# EAGLE design controller (EAGLE 9.2.2)
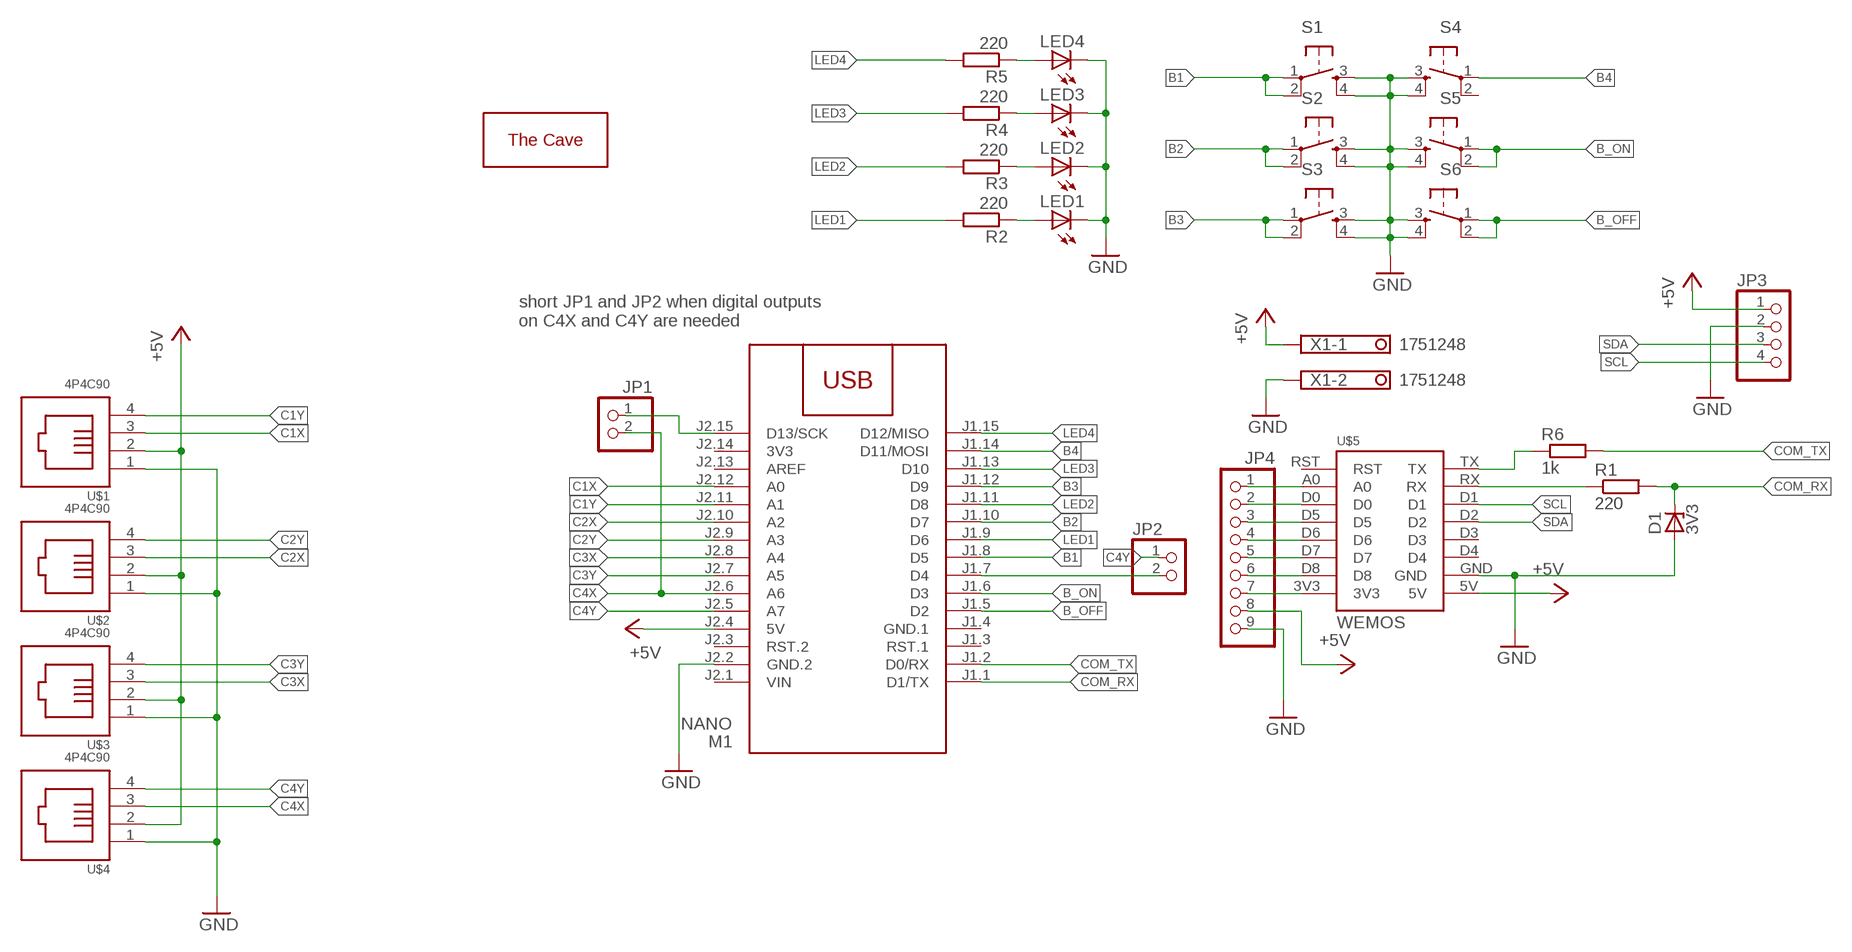
[diagram p0: schematic, sheet 1]

## Parts
D1  3V3  ZENER-DIODEZD-7.5  [ZDIO-7.5]
JP1  PINHD-1X2  [1X02]
JP2  PINHD-1X2  [1X02]
JP3  PINHD-1X4  [1X04]
JP4  PINHD-1X9  [1X09]
LED1  LED5MM  [LED5MM]
LED2  LED5MM  [LED5MM]
LED3  LED5MM  [LED5MM]
LED4  LED5MM  [LED5MM]
M1  NANO  ARDUINO-NANO-3.0#NOHOLE  [ARDUINO-NANO-3.0#NOHOLE]
R1  220  R-EU_0207/10  [0207/10]
R2  220  R-EU_R0805  [R0805]
R3  220  R-EU_R0805  [R0805]
R4  220  R-EU_R0805  [R0805]
R5  220  R-EU_R0805  [R0805]
R6  1k  R-EU_0207/10  [0207/10]
S1  TACT-SWITCH-6MM-THT  [TACT-SWITCH-6MM-THT]
S2  TACT-SWITCH-6MM-THT  [TACT-SWITCH-6MM-THT]
S3  TACT-SWITCH-6MM-THT  [TACT-SWITCH-6MM-THT]
S4  TACT-SWITCH-6MM-THT  [TACT-SWITCH-6MM-THT]
S5  TACT-SWITCH-6MM-THT  [TACT-SWITCH-6MM-THT]
S6  TACT-SWITCH-6MM-THT  [TACT-SWITCH-6MM-THT]
U$1  4P4C90  [4P4C-90]
U$2  4P4C90  [4P4C-90]
U$3  4P4C90  [4P4C-90]
U$4  4P4C90  [4P4C-90]
U$5  WEMOS  [WEMOS]
U$6  THECAVE_LOGO_NEW_TOP_SMALL  [NEW_LOGO_SMALL_TOP]
X1  1751248  [1751248]

## Nets
+5V: JP3.1 JP4.8 M1.J2.4(5V) U$1.2 U$2.2 U$3.2 U$4.2 U$5.5V X1.1
B1: M1.J1.8(D5) S1.1 S1.2
B2: M1.J1.10(D7) S2.1 S2.2
B3: M1.J1.12(D9) S3.1 S3.2
B4: M1.J1.14(D11/MOSI) S4.1
B_OFF: M1.J1.5(D2) S6.1 S6.2
B_ON: M1.J1.6(D3) S5.1 S5.2
C1X: M1.J2.12(A0) U$1.3
C1Y: M1.J2.11(A1) U$1.4
C2X: M1.J2.10(A2) U$2.3
C2Y: M1.J2.9(A3) U$2.4
C3X: M1.J2.8(A4) U$3.3
C3Y: M1.J2.7(A5) U$3.4
C4X: JP1.2 M1.J2.6(A6) U$4.3
C4Y: JP2.1 M1.J2.5(A7) U$4.4
COM_RX: D1.C M1.J1.1(D1/TX) R1.2
COM_TX: M1.J1.2(D0/RX) R6.2
GND: D1.A JP3.2 JP4.9 LED1.K(C) LED2.K(C) LED3.K(C) LED4.K(C) M1.J2.2(GND.2) S1.3 S1.4 S2.3 S2.4 S3.3 S3.4 S4.3 S4.4 S5.3 S5.4 S6.3 S6.4 U$1.1 U$2.1 U$3.1 U$4.1 U$5.GND X1.2
LED1: M1.J1.9(D6) R2.2
LED2: M1.J1.11(D8) R3.2
LED3: M1.J1.13(D10) R4.2
LED4: M1.J1.15(D12/MISO) R5.2
N$1: LED4.A R5.1
N$2: R1.1 U$5.RX
N$3: LED3.A R4.1
N$4: LED2.A R3.1
N$5: LED1.A R2.1
N$6: JP1.1 M1.J2.15(D13/SCK)
N$7: JP2.2 M1.J1.7(D4)
N$8: JP4.2 U$5.D0
N$9: JP4.3 U$5.D5
N$10: JP4.4 U$5.D6
N$11: JP4.5 U$5.D7
N$12: JP4.6 U$5.D8
N$13: JP4.1 U$5.A0
N$14: R6.1 U$5.TX
N$15: JP4.7 U$5.3V3
SCL: JP3.4 U$5.D1
SDA: JP3.3 U$5.D2
Unconnected: M1.J1.3(RST.1) M1.J2.3(RST.2) M1.J2.13(AREF) S4.2 U$5.D3 U$5.D4 U$5.RST

## Notes on the sheet
- short JP1 and JP2 when digital outputs
  on C4X and C4Y are needed

## Power pins joined to a net without a drawn wire
3V3: M1.J2.14(3V3)
GND.1: M1.J1.4(GND.1)
VIN: M1.J2.1(VIN)

## Library data of the parts
D1 = diode:ZENER-DIODE: Z-Diode
JP1 JP2 = pinhead:PINHD-1X2: PIN HEADER
JP3 = pinhead:PINHD-1X4: PIN HEADER
JP4 = pinhead:PINHD-1X9: PIN HEADER
LED1-LED4 = led:LED: LED OSRAM: - CHIPLED LG R971, LG N971, LY N971, LG Q971, LY Q971, LO R971, LY R971 LH N974, LH R974 LS Q976, LO Q976, LY Q976 LO Q996 - Hyper CHIPLED LW Q18S LB Q993, LB Q99A, LB R99A - SideLED LS A670, LO A670, LY A670, LG A670, LP A670 LB A673, LV A673, LT A673, LW A673 LH A674 LY A675 LS A676, LA A676, LO A676, LY A676, LW A676 LS A679, LY A679, LG A679 - Hyper Micro SIDELED® LS Y876, LA Y876, LO Y876, LY Y876 LT Y87S - SmartLED LW L88C, LW L88S LB L89C, LB L89S, LG L890 LS L89K, LO L89K, LY L89K LS L896, LA L896, LO L896, LY L896 - TOPLED LS T670, LO T670, LY T670, LG T670, LP T670 LSG T670, LSP T670, LSY T670, LOP T670, LYG T670 LG T671, LOG T671, LSG T671 LB T673, LV T673, LT T673, LW T673 LH T674 LS T676, LA T676, LO T676, LY T676, LB T676, LH T676, LSB T676, LW T676 LB T67C, LV T67C, LT T67C, LS T67K, LO T67K, LY T67K, LW E67C LS E67B, LA E67B, LO E67B, LY E67B, LB E67C, LV E67C, LT E67C LW T67C LS T679, LY T679, LG T679 LS T770, LO T770, LY T770, LG T770, LP T770 LB T773, LV T773, LT T773, LW T773 LH T774 LS E675, LA E675, LY E675, LS T675 LS T776, LA T776, LO T776, LY T776, LB T776 LHGB T686 LT T68C, LB T68C - Hyper Mini TOPLED® LB M676 - Mini TOPLED Santana® LG M470 LS M47K, LO M47K, LY M47K Source: http://www.osram.convergy.de LUXEON: - LUMILED® LXK2-PW12-R00, LXK2-PW12-S00, LXK2-PW14-U00, LXK2-PW14-V00 LXK2-PM12-R00, LXK2-PM12-S00, LXK2-PM14-U00 LXK2-PE12-Q00, LXK2-PE12-R00, LXK2-PE12-S00, LXK2-PE14-T00, LXK2-PE14-U00 LXK2-PB12-K00, LXK2-PB12-L00, LXK2-PB12-M00, LXK2-PB14-N00, LXK2-PB14-P00, LXK2-PB14-Q00 LXK2-PR12-L00, LXK2-PR12-M00, LXK2-PR14-Q00, LXK2-PR14-R00 LXK2-PD12-Q00, LXK2-PD12-R00, LXK2-PD12-S00 LXK2-PH12-R00, LXK2-PH12-S00 LXK2-PL12-P00, LXK2-PL12-Q00, LXK2-PL12-R00 Source: www.luxeon.com KINGBRIGHT: KA-3528ASYC Source: www.kingbright.com
M1 = diy-modules:ARDUINO-NANO-3.0: Arduino Nano 3.0
R1-R6 = rcl:R-EU_: RESISTOR, European symbol; SPICEPREFIX: R
S1-S6 = thecave:TACT-SWITCH-6MM
U$1-U$4 = thecave:4P4C: 4p4c rj9 rj14 https://www.gme.cz/rj-konektor-webp-4-4-180 https://www.gme.cz/rj-konektor-webp-4-4-lp
U$5 = d1-mini:WEMOS
U$6 = thecave:THECAVE_LOGO: The Cave DIY workshop logos thecave.cz
X1 = con-phoenix-350:1751248: MKDS 1/ 2-3,5 Printklemme Nennstrom: 10 A Bemessungsspannung: 160 V Raster: 3,5 mm Polzahl: 2 Montageart: Löten Anschlussart: Schraubanschluss Anschlussrichtung vom Leiter zur Platine: 0° Source: http://eshop.phoenixcontact.com .. 1751248.pdf; OC_FARNELL: unknown; OC_NEWARK: unknown

## Board
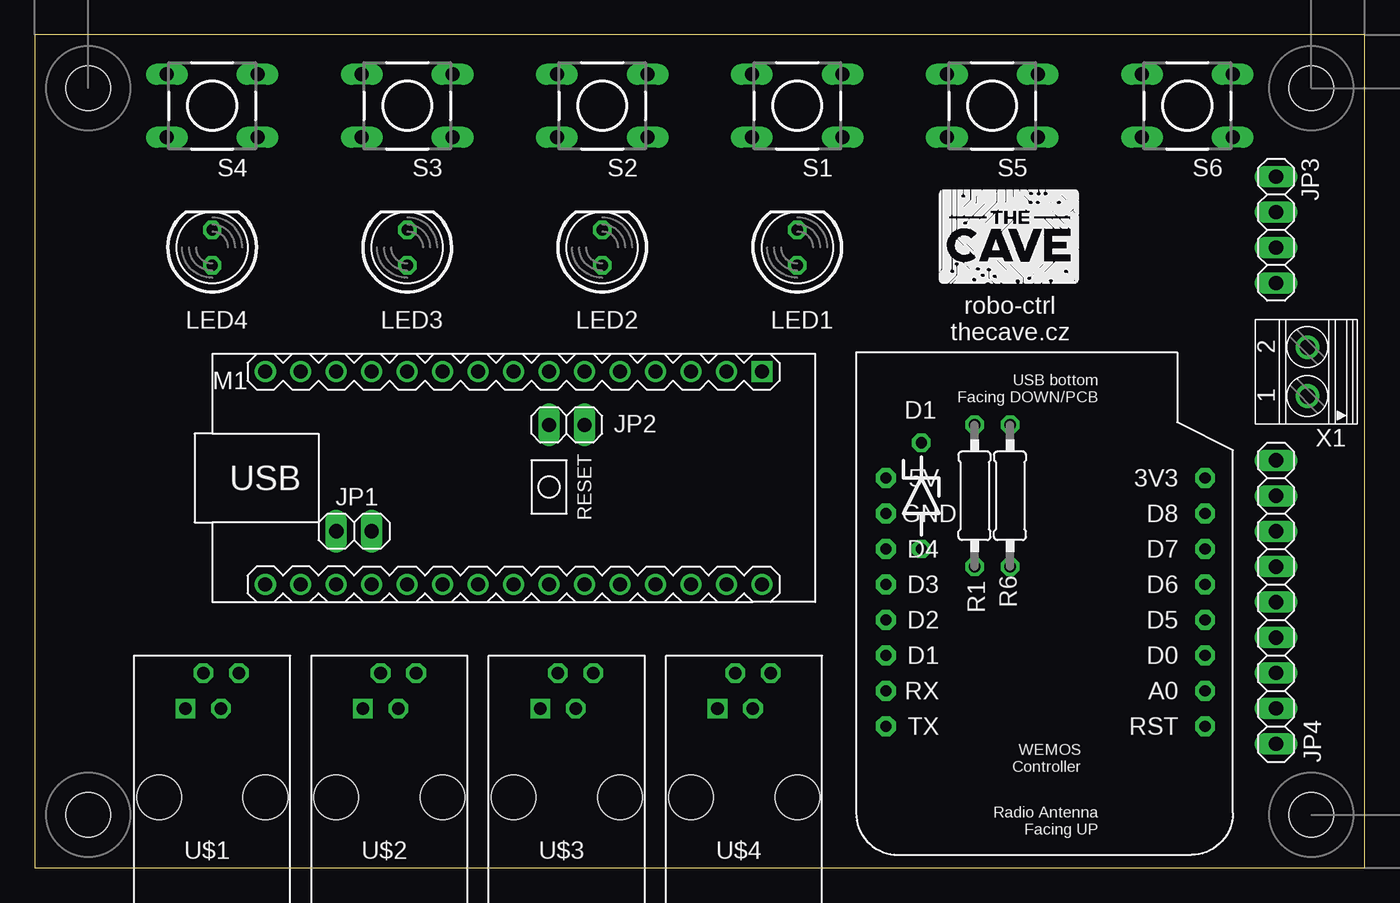
[diagram p1: board, top side]
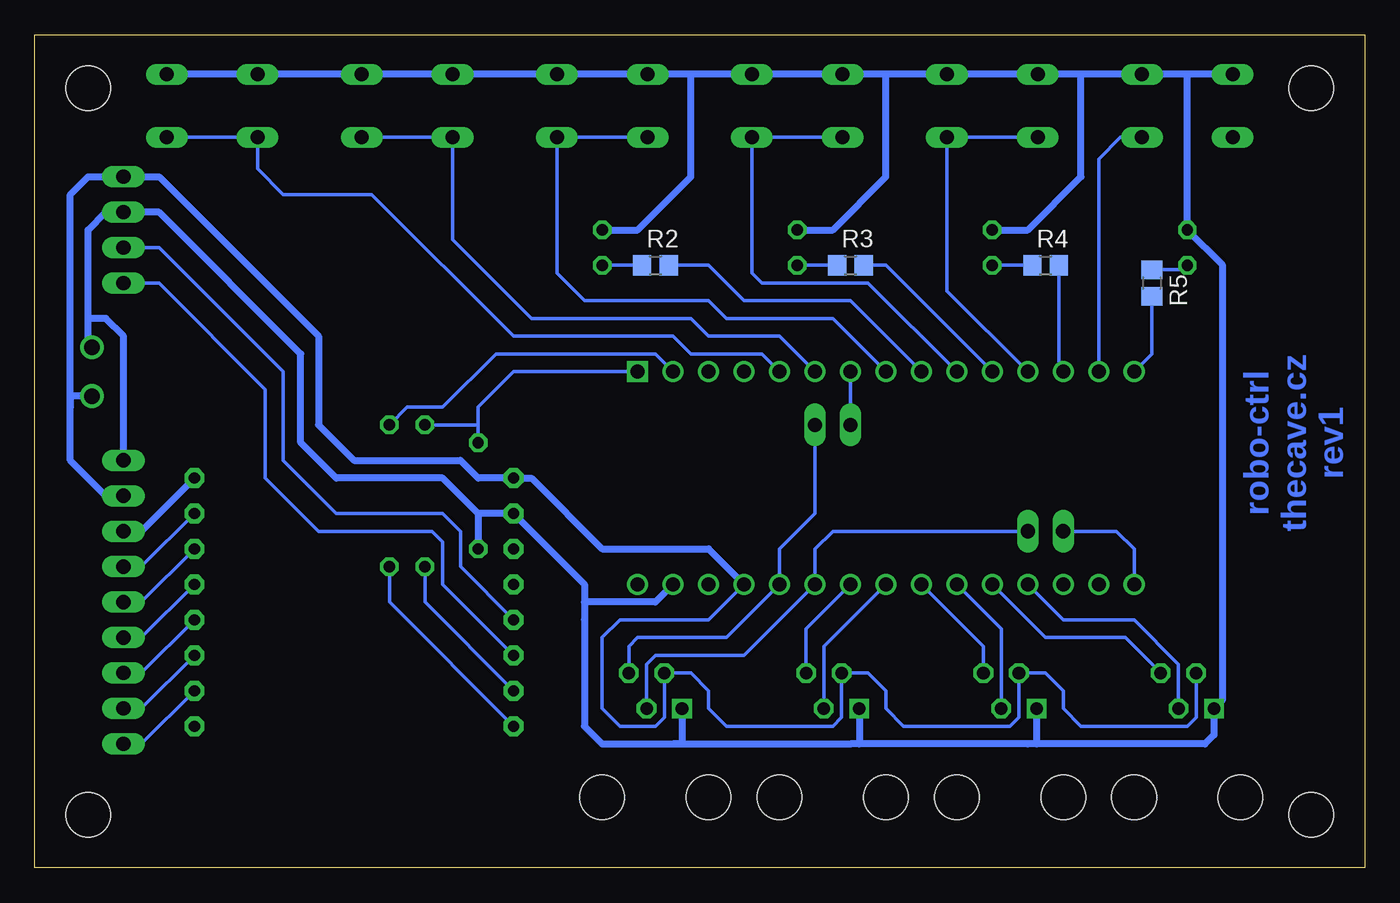
[diagram p2: board, bottom side, seen from below]

Size 95.25 x 59.69 mm. Coordinates in mm from the lower left corner, seen from the top.
Outline: 0,0 95.25,0 95.25,59.69 0,59.69 0,0
Copper layers (1*16): Top 0.035mm / dielectric 1.5mm / Bottom 0.035mm
Design rules "default *": minimum track width 10mil, minimum drill 0.5mm, track to track 10mil, track to pad 10mil, pad to pad 10mil, via to via 10mil, smd to smd 10mil, copper to edge 24mil, drill to drill 10mil, minimum pad ring 10mil, minimum via ring 8mil, stop-mask expansion 4mil, vias tented up to drill 0mil, thermal gap 10mil
Holes 3.2 mm at 3.81,55.88 3.81,3.81 91.44,55.88 91.44,3.81

### Footprints (pad centres in the part's own frame; a part is rotated, then mirrored left to right if it is on the bottom)
ZDIO-7.5 = drill 0.813 octagon: A 3.81,0; C -3.81,0
1X02 = drill 1.016 long: 1 -1.27,0; 2 1.27,0
1X04 = drill 1.016 long: 1 -3.81,0; 2 -1.27,0; 3 1.27,0; 4 3.81,0
1X09 = drill 1.016 long: 1 -10.16,0; 2 -7.62,0; 3 -5.08,0; 4 -2.54,0; 5 0,0; 6 2.54,0; 7 5.08,0; 8 7.62,0; 9 10.16,0
LED5MM = drill 0.813 octagon: A -1.27,0; K 1.27,0
ARDUINO-NANO-3.0#NOHOLE = drill 1 square: J1.1 17.78,7.62 | drill 1: J1.2 15.24,7.62; J1.3 12.7,7.62; J1.4 10.16,7.62; J1.5 7.62,7.62; J1.6 5.08,7.62; J1.7 2.54,7.62; J1.8 0,7.62; J1.9 -2.54,7.62; J1.10 -5.08,7.62; J1.11 -7.62,7.62; J1.12 -10.16,7.62; J1.13 -12.7,7.62; J1.14 -15.24,7.62; J1.15 -17.78,7.62; J2.1 17.78,-7.62; J2.2 15.24,-7.62; J2.3 12.7,-7.62; J2.4 10.16,-7.62; J2.5 7.62,-7.62; J2.6 5.08,-7.62; J2.7 2.54,-7.62; J2.8 0,-7.62; J2.9 -2.54,-7.62; J2.10 -5.08,-7.62; J2.11 -7.62,-7.62; J2.12 -10.16,-7.62; J2.13 -12.7,-7.62; J2.14 -15.24,-7.62; J2.15 -17.78,-7.62
0207/10 = drill 0.813 octagon: 1 -5.08,0; 2 5.08,0
R0805 = smd 1.3 x 1.5: 1 -0.95,0; 2 0.95,0
TACT-SWITCH-6MM-THT = drill 1 long: 1 -3.25,2.25; 2 3.25,2.25; 3 -3.25,-2.25; 4 3.25,-2.25
4P4C-90 = drill 0.9 square: 1 1.905,-6.35 | drill 0.9 octagon: 2 0.635,-8.89; 3 -0.635,-6.35; 4 -1.905,-8.89 | hole 3.2: -3.81,0; 3.81,0
WEMOS = drill 0.8 pad 1.422 octagon: 3V3 0,0; 5V 22.86,0; A0 0,15.24; D0 0,12.7; D1 22.86,12.7; D2 22.86,10.16; D3 22.86,7.62; D4 22.86,5.08; D5 0,10.16; D6 0,7.62; D7 0,5.08; D8 0,2.54; GND 22.86,2.54; RST 0,17.78; RX 22.86,15.24; TX 22.86,17.78
1751248 = drill 1.1 pad 1.7: 1 -1.75,-0.1; 2 1.75,-0.1

### Placement (x,y rotation side)
D1  63.5,26.67 270 top
JP1  22.86,24.13 0 top
JP2  38.1,31.75 180 top
JP3  88.9,45.72 270 top
JP4  88.9,19.05 90 top
LED1  54.61,44.45 90 top
LED2  40.64,44.45 90 top
LED3  26.67,44.45 90 top
LED4  12.7,44.45 90 top
M1  34.29,27.94 0 top
R1  67.31,26.67 90 top
R2  50.8,43.18 0 bottom
R3  36.83,43.18 0 bottom
R4  22.86,43.18 0 bottom
R5  15.24,41.91 270 bottom
R6  69.85,26.67 90 top
S1  54.61,54.61 180 top
S2  40.64,54.61 180 top
S3  26.67,54.61 180 top
S4  12.7,54.61 180 top
S5  68.58,54.61 180 top
S6  82.55,54.61 180 top
U$1  12.7,5.08 180 top
U$2  25.4,5.08 180 top
U$3  38.1,5.08 180 top
U$4  50.8,5.08 180 top
U$5  83.82,27.94 180 top
U$6  64.77,41.91 0 top
X1  91.06,35.56 90 top

### Tracks (layer width: path | path; a pad name or v marks a point on that pad's centre or on a via)
+5V
  Bottom 0.254: U$1.2 12.06,10.79 12.7,10.16 20.32,10.16 21.59,11.43 21.59,12.7 22.86,13.97 U$2.2 24.77,10.79 25.4,10.16 33.02,10.16 34.29,11.43 34.29,12.7 35.56,13.97 U$3.2 37.46,10.79 38.1,10.16 45.72,10.16 46.99,11.43 46.99,12.7 48.26,13.97 U$4.2 50.16,10.79 50.8,10.16 53.34,10.16 54.61,11.43 54.61,16.51 53.34,17.78 46.99,17.78 M1.J2.4
  Bottom 0.508: M1.J2.4 46.99,22.86 54.61,22.86 59.69,27.94 U$5.5V 63.5,27.94 64.77,29.21 72.39,29.21 74.93,31.75 74.93,38.1 86.36,49.53 JP3.1 91.44,49.53 92.71,48.26 92.71,33.02 | JP4.8 90.17,26.67 92.71,29.21 92.71,33.02 | X1.1 92.71,33.81 92.71,33.02
B1
  Bottom 0.254: S1.2 S1.1 57.86,42.62 55.88,40.64 46.99,40.64 45.72,39.37 38.1,39.37 M1.J1.8
B2
  Bottom 0.254: S2.2 S2.1 43.89,42.62 43.18,41.91 35.56,41.91 M1.J1.10
B3
  Bottom 0.254: S3.2 S3.1 29.92,41.35 M1.J1.12
B4
  Bottom 0.254: M1.J1.14 19.05,50.8 17.49,52.36 16.51,52.36 S4.1
B_OFF
  Bottom 0.254: S6.1 S6.2 79.3,50.09 77.47,48.26 71.12,48.26 60.96,38.1 49.53,38.1 48.26,36.83 43.18,36.83 M1.J1.5
B_ON
  Bottom 0.254: S5.1 S5.2 65.33,45.01 59.69,39.37 48.26,39.37 46.99,38.1 41.91,38.1 M1.J1.6
C1X
  Bottom 0.254: U$1.3 13.34,14.61 16.51,17.78 21.59,17.78 M1.J2.12
C1Y
  Bottom 0.254: U$1.4 17.14,16.51 22.86,16.51 M1.J2.11
C2X
  Bottom 0.254: U$2.3 26.03,17.14 M1.J2.10
C2Y
  Bottom 0.254: U$2.4 27.3,15.88 M1.J2.9
C3X
  Bottom 0.254: U$3.3 38.73,15.88 M1.J2.8
C3Y
  Bottom 0.254: U$3.4 40.01,17.14 M1.J2.7
C4X
  Bottom 0.254: U$4.3 51.44,14.61 50.8,15.24 44.45,15.24 M1.J2.6 39.37,22.86 38.1,24.13 JP1.2
C4Y
  Bottom 0.254: U$4.4 52.7,15.88 52.07,16.51 45.72,16.51 M1.J2.5 41.91,22.86 39.37,25.4 JP2.1
COM_RX
  Bottom 0.254: M1.J1.1 60.96,35.56 63.5,33.02 D1.C 63.5,31.75 R1.2
COM_TX
  Bottom 0.254: M1.J1.2 50.8,36.83 62.23,36.83 66.04,33.02 68.58,33.02 R6.2
GND
  Bottom 0.508: 24.13,8.89 11.43,8.89 10.79,9.53 U$1.1 10.16,12.06 10.16,43.18 LED4.K 12.7,56.86 | 24.13,8.89 36.83,8.89 | 49.53,8.89 36.83,8.89 | U$2.1 23.49,8.89 24.13,8.89 | U$3.1 36.2,8.89 36.83,8.89 | U$4.1 48.9,8.89 49.53,8.89 | M1.J2.2 50.8,19.05 55.88,19.05 | 49.53,8.89 54.61,8.89 55.88,10.16 55.88,17.78 55.88,19.05 | 55.88,19.05 55.88,20.32 U$5.GND 63.5,25.4 | S4.4 12.7,56.86 | 12.7,56.86 S4.3 20.32,56.86 | 20.32,56.86 S3.4 S3.3 34.29,56.86 | 34.29,56.86 S2.4 S2.3 48.26,56.86 | 48.26,56.86 S1.4 S1.3 S5.4 S5.3 S6.4 S6.3 | LED3.K 24.13,45.72 20.32,49.53 20.32,56.86 | LED2.K 38.1,45.72 34.29,49.53 34.29,56.86 | LED1.K 52.07,45.72 48.26,49.53 48.26,56.86 | 63.5,25.4 D1.A | 63.5,25.4 66.04,27.94 73.66,27.94 76.2,30.48 76.2,36.83 86.36,46.99 JP3.2 90.17,46.99 91.44,45.72 91.44,39.37 | X1.2 91.44,37.31 91.44,39.37 | JP4.9 88.9,38.1 90.17,39.37 91.44,39.37
LED1
  Bottom 0.254: M1.J1.9 36.83,40.64 44.45,40.64 46.99,43.18 R2.2
LED2
  Bottom 0.254: M1.J1.11 34.29,43.18 R3.2
LED3
  Bottom 0.254: R4.2 21.91,35.88 M1.J1.13
LED4
  Bottom 0.254: R5.2 15.24,36.83 M1.J1.15
N$1
  Bottom 0.254: R5.1 13.02,42.86 LED4.A
N$2
  Bottom 0.254: U$5.RX 67.31,19.05 R1.1
N$3
  Bottom 0.254: R4.1 LED3.A
N$4
  Bottom 0.254: R3.1 LED2.A
N$5
  Bottom 0.254: R2.1 LED1.A
N$6
  Bottom 0.254: M1.J2.15 16.51,22.86 17.78,24.13 JP1.1
N$7
  Bottom 0.254: M1.J1.7 JP2.2
N$8
  Bottom 0.254: JP4.2 87.63,11.43 U$5.D0
N$9
  Bottom 0.254: JP4.3 87.63,13.97 U$5.D5
N$10
  Bottom 0.254: JP4.4 87.63,16.51 U$5.D6
N$11
  Bottom 0.254: JP4.5 87.63,19.05 U$5.D7
N$12
  Bottom 0.254: JP4.6 87.63,21.59 U$5.D8
N$13
  Bottom 0.254: JP4.1 87.63,8.89 U$5.A0
N$14
  Bottom 0.254: U$5.TX 69.85,19.05 R6.1
N$15
  Bottom 0.508: JP4.7 87.63,24.13 U$5.3V3
SCL
  Bottom 0.254: U$5.D1 66.04,20.32 66.04,23.37 66.8,24.13 74.93,24.13 78.74,27.94 78.74,34.29 86.36,41.91 JP3.4
SDA
  Bottom 0.254: U$5.D2 64.77,21.59 64.77,24.13 66.04,25.4 73.66,25.4 77.47,29.21 77.47,35.56 86.36,44.45 JP3.3

### Text on the board
Bottom: robo-ctrl / thecave.cz / rev1
tPlace: robo-ctrl / thecave.cz